# EAGLE design ESP adapter circuit diagram (EAGLE 7.2.0)
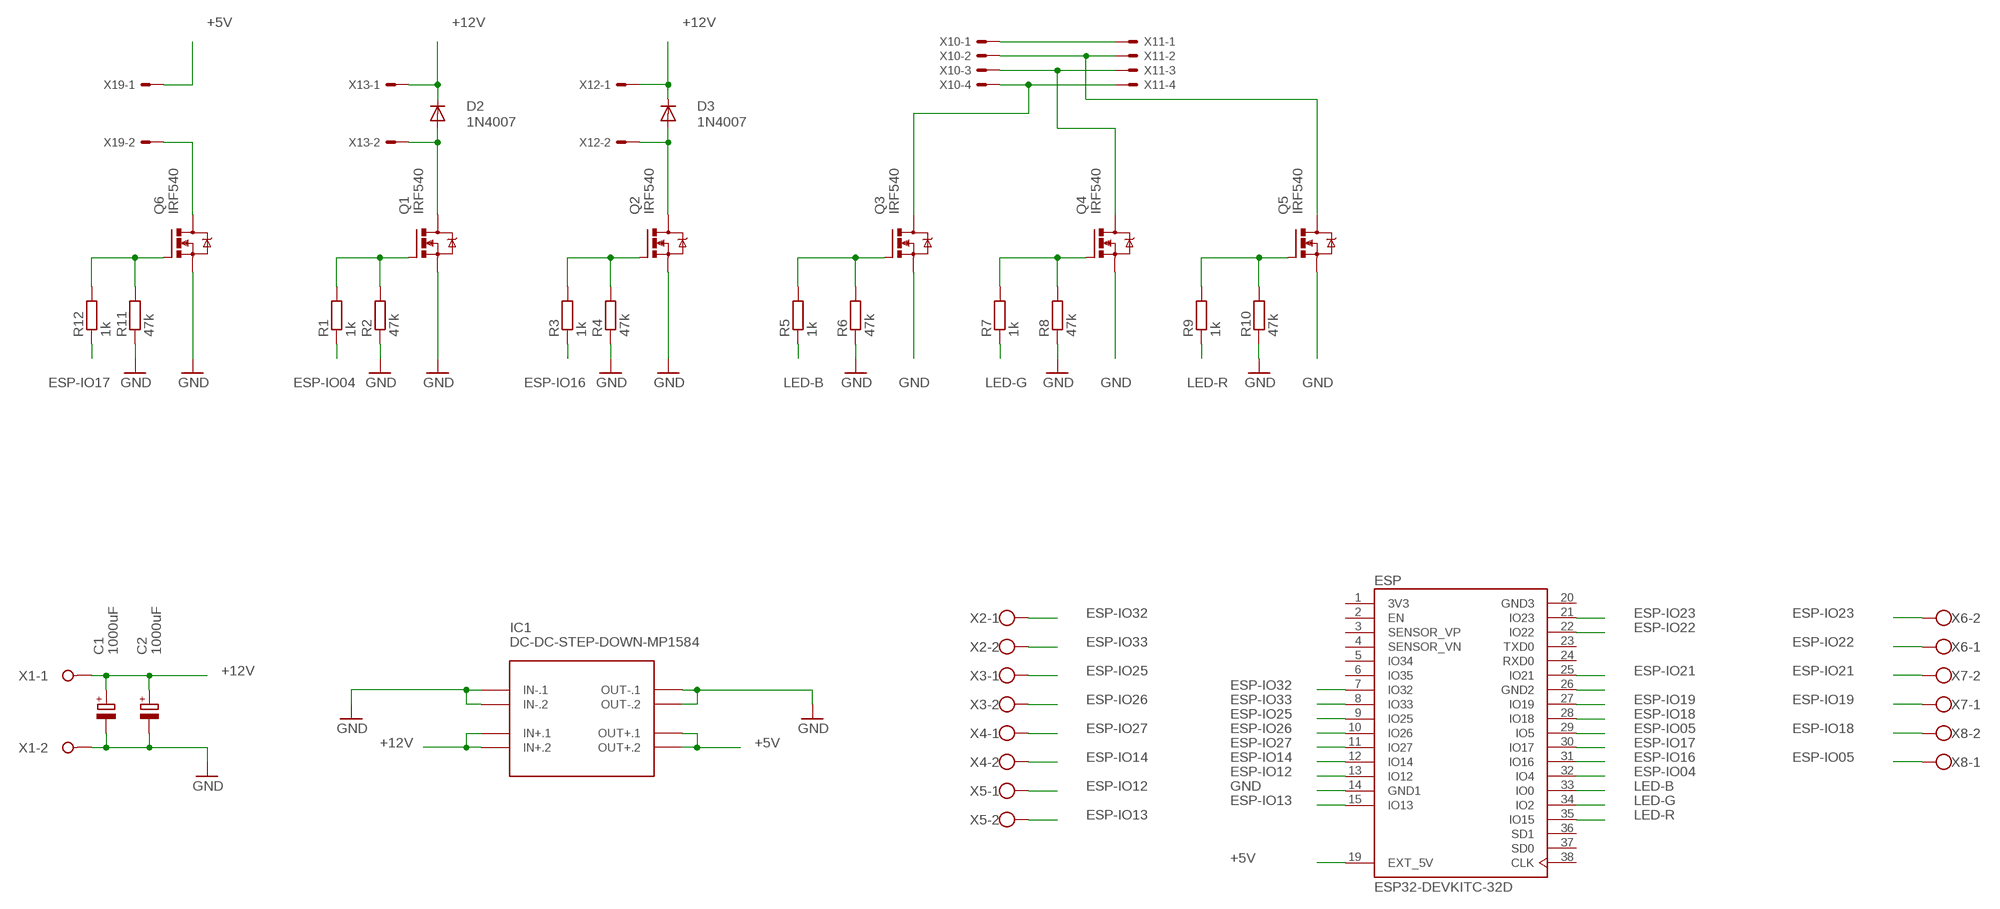
[diagram p0: schematic, sheet 1]

## Parts
C1  1000uF  CPOL-EUE5-13  [E5-13]
C2  1000uF  CPOL-EUE5-13  [E5-13]
D2  1N4007  1N4004  [DO41-10]
D3  1N4007  1N4004  [DO41-10]
ESP  ESP32-DEVKITC-32D  [MODULE_ESP32-DEVKITC-32D]
IC1  DC-DC-STEP-DOWN-MP1584  [DC-DC-STEP-DOWN-MP1584]
Q1  IRF540  [TO220BV]
Q2  IRF540  [TO220BV]
Q3  IRF540  [TO220BV]
Q4  IRF540  [TO220BV]
Q5  IRF540  [TO220BV]
Q6  IRF540  [TO220BV]
R1  1k  R-EU_0204/7  [0204/7]
R2  47k  R-EU_0204/7  [0204/7]
R3  1k  R-EU_0204/7  [0204/7]
R4  47k  R-EU_0204/7  [0204/7]
R5  1k  R-EU_0204/7  [0204/7]
R6  47k  R-EU_0204/7  [0204/7]
R7  1k  R-EU_0204/7  [0204/7]
R8  47k  R-EU_0204/7  [0204/7]
R9  1k  R-EU_0204/7  [0204/7]
R10  47k  R-EU_0204/7  [0204/7]
R11  47k  R-EU_0204/7  [0204/7]
R12  1k  R-EU_0204/7  [0204/7]
X1  GND  W237-02P  [W237-132]
X2  W237-102  [W237-102]
X3  W237-102  [W237-102]
X4  W237-102  [W237-102]
X5  W237-102  [W237-102]
X6  W237-102  [W237-102]
X7  W237-102  [W237-102]
X8  W237-102  [W237-102]
X10  22-27-2041-04  [6410-04]
X11  22-27-2041-04  [6410-04]
X12  22-27-2021-02  [6410-02]
X13  22-27-2021-02  [6410-02]
X19  22-27-2021-02  [6410-02]

## Nets
+5V: ESP.19(EXT_5V) IC1.OUT+.1 IC1.OUT+.2 X19.1
+12V: C1.+ C2.+ D2.C D3.C IC1.IN+.1 IC1.IN+.2 X1.1 X10.1 X11.1 X12.1 X13.1
ESP-IO04: ESP.32(IO4) R1.1
ESP-IO05: ESP.29(IO5) X8.1
ESP-IO12: ESP.13(IO12) X5.1
ESP-IO13: ESP.15(IO13) X5.2
ESP-IO14: ESP.12(IO14) X4.2
ESP-IO16: ESP.31(IO16) R3.1
ESP-IO17: ESP.30(IO17) R12.1
ESP-IO18: ESP.28(IO18) X8.2
ESP-IO19: ESP.27(IO19) X7.1
ESP-IO21: ESP.25(IO21) X7.2
ESP-IO22: ESP.22(IO22) X6.1
ESP-IO23: ESP.21(IO23) X6.2
ESP-IO25: ESP.9(IO25) X3.1
ESP-IO26: ESP.10(IO26) X3.2
ESP-IO27: ESP.11(IO27) X4.1
ESP-IO32: ESP.7(IO32) X2.1
ESP-IO33: ESP.8(IO33) X2.2
GND: C1.- C2.- ESP.14(GND1) IC1.IN-.1 IC1.IN-.2 IC1.OUT-.1 IC1.OUT-.2 Q1.S Q2.S Q3.S Q4.S Q5.S Q6.S R2.1 R4.1 R6.1 R8.1 R10.1 R11.1 X1.2
LED-B: ESP.33(IO0) R5.1
LED-G: ESP.34(IO2) R7.1
LED-R: ESP.35(IO15) R9.1
N$3: ESP.26(GND2)
N$25: Q1.G R1.2 R2.2
N$26: Q2.G R3.2 R4.2
N$27: Q3.G R5.2 R6.2
N$28: D2.A Q1.D X13.2
N$29: Q5.D X10.2 X11.2
N$30: Q6.G R11.2 R12.2
N$31: Q3.D X10.4 X11.4
N$33: Q4.D X10.3 X11.3
N$34: Q4.G R7.2 R8.2
N$35: Q5.G R9.2 R10.2
N$39: Q6.D X19.2
N$41: D3.A Q2.D X12.2
Unconnected: ESP.2(EN) ESP.3(SENSOR_VP) ESP.4(SENSOR_VN) ESP.5(IO34) ESP.6(IO35) ESP.23(TXD0) ESP.24(RXD0) ESP.36(SD1) ESP.37(SD0) ESP.38(CLK)

## Power pins joined to a net without a drawn wire
3V3: ESP.1(3V3)
GND3: ESP.20(GND3)

## Library data of the parts
C1 C2 = rcl:CPOL-EU: POLARIZED CAPACITOR, European symbol
D2 D3 = diode:1N4004: DIODE general purpose rectifier, 1 A
ESP = ESP32-DEVKITC-32D-final:ESP32-DEVKITC-32D: Eval Board For Esp-Wroom-32; AVAILABILITY: Unavailable; DESCRIPTION: Eval Board For Esp-Wroom-32; MF: Espressif Systems; MP: ESP32-DEVKITC-32D; PACKAGE: None; PRICE: None
IC1 = diy-modules:DC-DC-STEP-DOWN-MP1584: DC/DC Step-Down Regulator based on MP1584 chip MP1584 datasheet available here: http://www.haoyuelectronics.com/Attachment/MP1584/MP1584.pdf Click here to find device on ebay.com <http://www.ebay.com/sch/mp1584+module>
Q1-Q6 = transistor-power:IRF540: HEXFET Power MOSFET
R1-R12 = rcl:R-EU_: RESISTOR, European symbol
X1 = con-wago-508:W237-02P: WAGO SREW CLAMP; OC_FARNELL: unknown; OC_NEWARK: unknown
X2-X8 = con-wago-500:W237-102: WAGO SCREW CLAMP; MPN: 237-102; OC_FARNELL: unknown; OC_NEWARK: 70K9898
X10 X11 = con-molex:22-?-04: CONNECTOR wire to board 2.54 mm (.1 inch) pitch header; OC_FARNELL: unknown; OC_NEWARK: unknown
X12 X13 X19 = con-molex:22-?-02: CONNECTOR wire to board 2.54 mm (.1 inch) pitch header; OC_FARNELL: unknown; OC_NEWARK: unknown

## Board
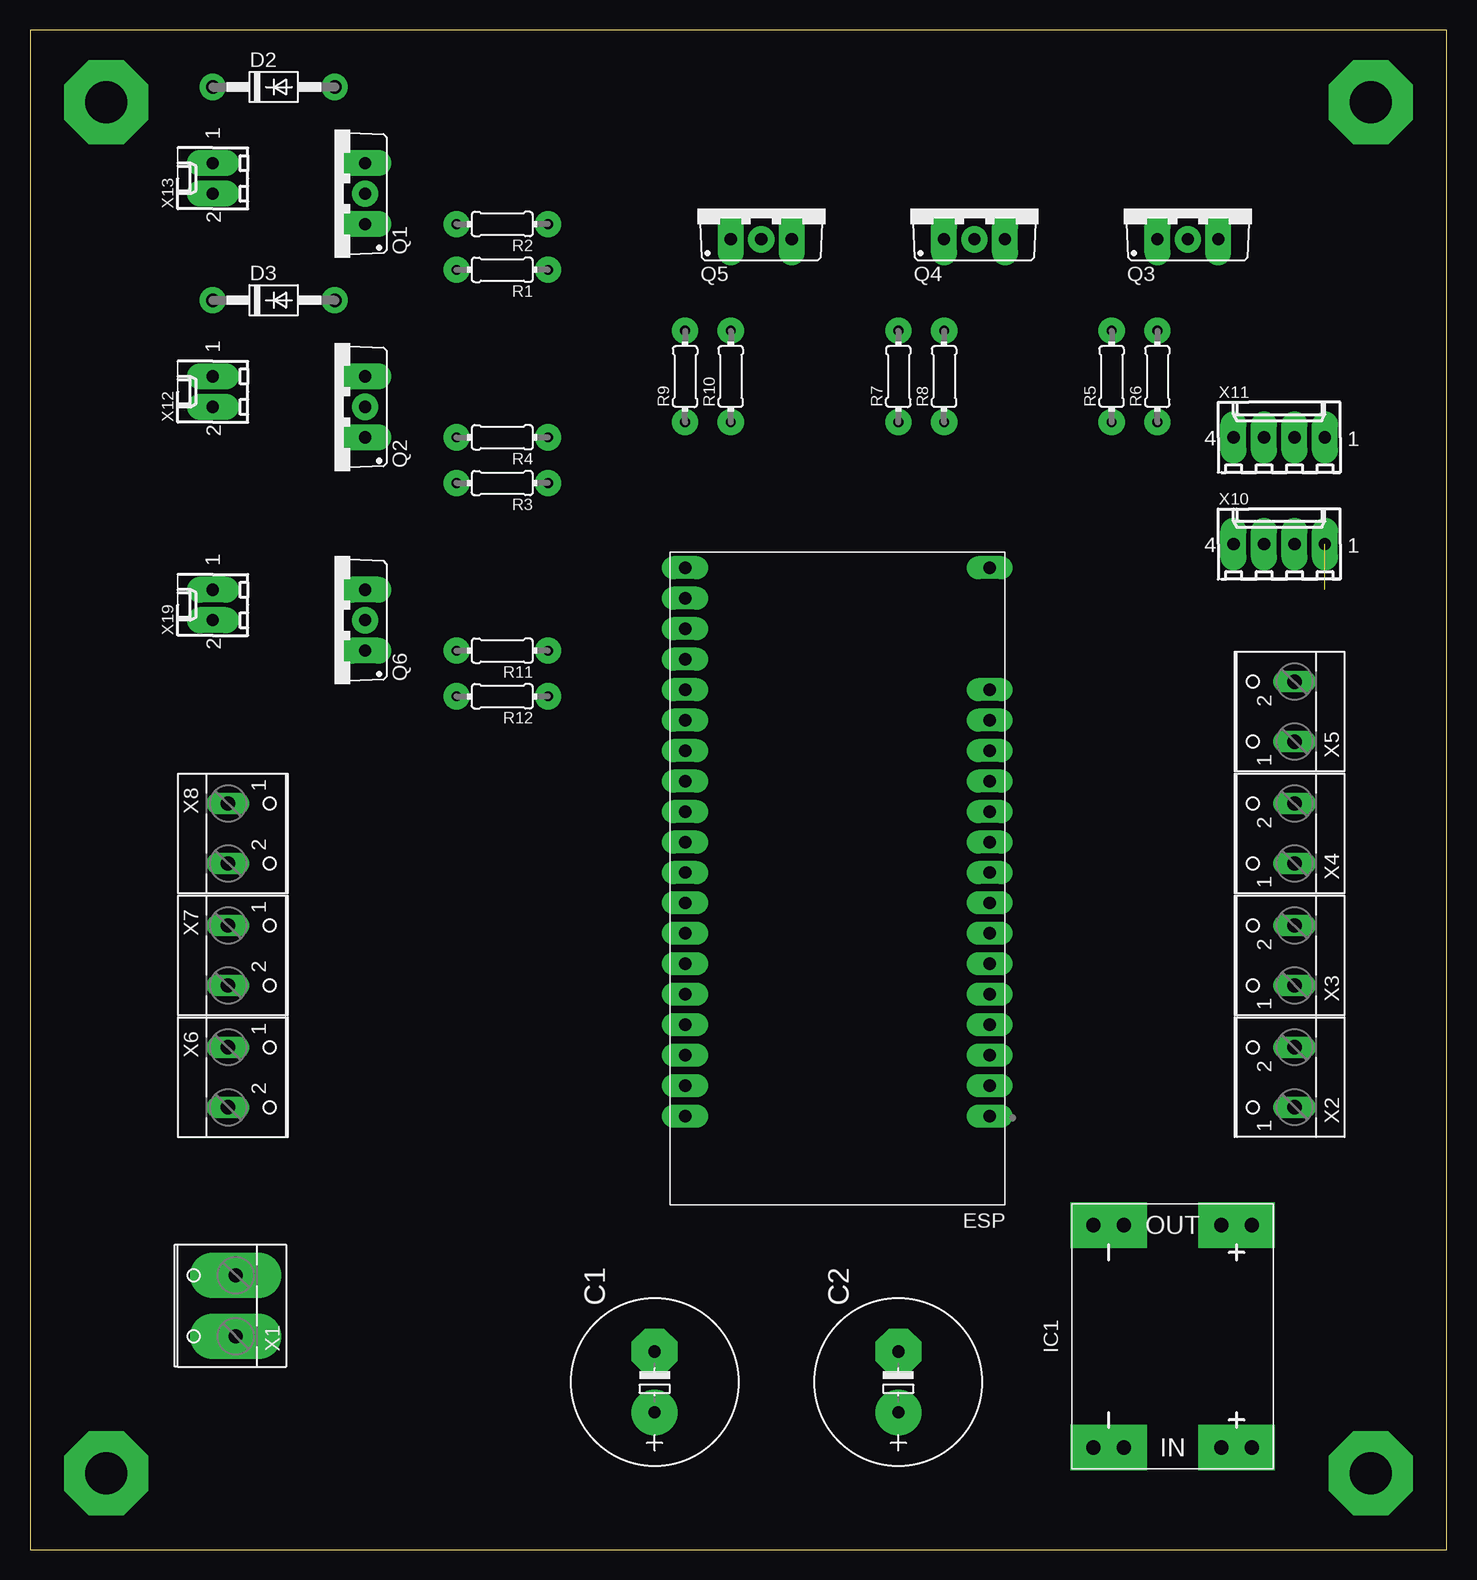
[diagram p1: board, top side]
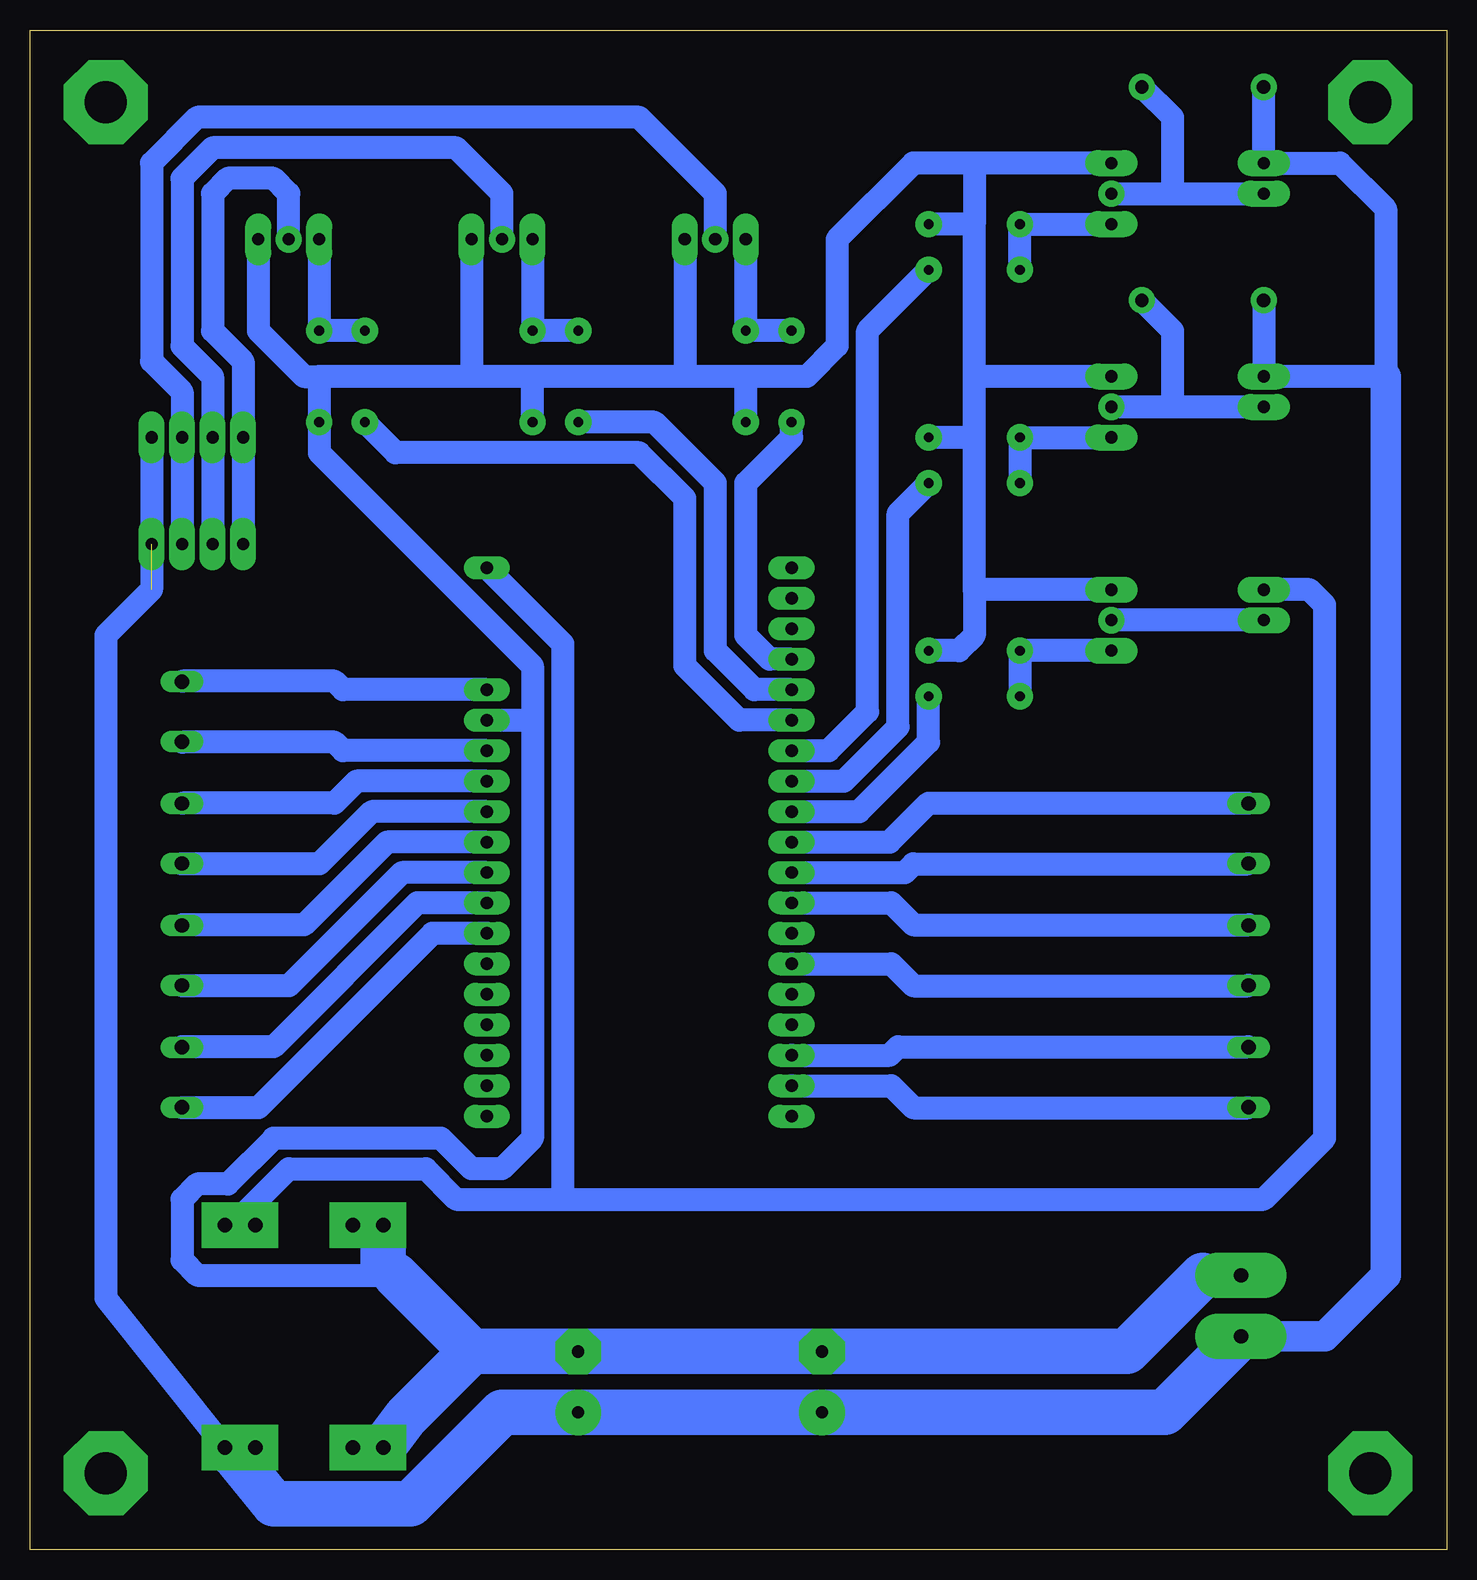
[diagram p2: board, bottom side, seen from below]

Size 118.09 x 126.67 mm. Coordinates in mm from the lower left corner, seen from the top.
Outline: 0,0 118.09,0 118.09,126.67 0,126.67 0,0
Copper layers (1*16): Top 0.035mm / dielectric 1.5mm / Bottom 0.035mm
Design rules "default": minimum track width 10mil, minimum drill 24mil, track to track 8mil, track to pad 8mil, pad to pad 8mil, via to via 8mil, smd to smd 8mil, copper to edge 40mil, drill to drill 8mil, minimum pad ring 10mil, minimum via ring 8mil, stop-mask expansion 4mil, vias tented up to drill 0mil, thermal gap 10mil

### Footprints (pad centres in the part's own frame; a part is rotated, then mirrored left to right if it is on the bottom)
E5-13 = drill 1.016 pad 3.81: + -2.54,0 | drill 1.016 pad 3.81 octagon: - 2.54,0
DO41-10 = drill 1.118 pad 2.184: A 5.08,0; C -5.08,0
MODULE_ESP32-DEVKITC-32D = drill 1.04 pad 1.93 long: 1 -12.7,19.76; 2 -12.7,17.22; 3 -12.7,14.68; 4 -12.7,12.14; 5 -12.7,9.6; 6 -12.7,7.06; 7 -12.7,4.52; 8 -12.7,1.98; 9 -12.7,-0.56; 10 -12.7,-3.1; 11 -12.7,-5.64; 12 -12.7,-8.18; 13 -12.7,-10.72; 14 -12.7,-13.26; 15 -12.7,-15.8; 19 -12.7,-25.96; 20 12.7,19.76; 21 12.7,17.22; 22 12.7,14.68; 23 12.7,12.14; 24 12.7,9.6; 25 12.7,7.06; 26 12.7,4.52; 27 12.7,1.98; 28 12.7,-0.56; 29 12.7,-3.1; 30 12.7,-5.64; 31 12.7,-8.18; 32 12.7,-10.72; 33 12.7,-13.26; 34 12.7,-15.8; 35 12.7,-18.34; 36 12.7,-20.88; 37 12.7,-23.42; 38 12.7,-25.96
DC-DC-STEP-DOWN-MP1584 = drill 1.2 pad 3.81 square: IN+.1 -9.271,-4.064; IN+.2 -9.271,-6.604; IN-.1 -9.271,6.604; IN-.2 -9.271,4.064; OUT+.1 9.271,-4.064; OUT+.2 9.271,-6.604; OUT-.1 9.271,6.604; OUT-.2 9.271,4.064
TO220BV = drill 1.016 pad 2.184: D 0,-2.54 | drill 1.016 pad 2.184 long: G -2.54,-2.54; S 2.54,-2.54
0204/7 = drill 0.813 pad 2.184: 1 -3.81,0; 2 3.81,0
W237-132 = drill 1.194 pad 3.81 long: 1 -2.54,-0.635; 2 2.54,-0.635
W237-102 = drill 1.194 long: 1 -2.5,-1.27; 2 2.5,-1.27
6410-04 = drill 1.016 pad 2.184 long: 1 3.81,0; 2 1.27,0; 3 -1.27,0; 4 -3.81,0
6410-02 = drill 1.016 pad 2.184 long: 1 1.27,0; 2 -1.27,0

### Placement (x,y rotation side)
C1  52.07,13.97 90 top
C2  72.39,13.97 90 top
D2  20.32,121.92 0 top
D3  20.32,104.14 0 top
ESP  67.31,55.88 180 top
IC1  95.25,17.78 90 top
Q1  25.4,113.03 90 top
Q2  25.4,95.25 90 top
Q3  96.52,111.76 0 top
Q4  78.74,111.76 0 top
Q5  60.96,111.76 0 top
Q6  25.4,77.47 90 top
R1  39.37,106.68 180 top
R2  39.37,110.49 180 top
R3  39.37,88.9 180 top
R4  39.37,92.71 180 top
R5  90.17,97.79 90 top
R6  93.98,97.79 90 top
R7  72.39,97.79 90 top
R8  76.2,97.79 90 top
R9  54.61,97.79 90 top
R10  58.42,97.79 90 top
R11  39.37,74.93 180 top
R12  39.37,71.12 180 top
X1  16.51,20.32 90 top
X2  104.14,39.37 90 top
X3  104.14,49.53 90 top
X4  104.14,59.69 90 top
X5  104.14,69.85 90 top
X6  17.78,39.37 270 top
X7  17.78,49.53 270 top
X8  17.78,59.69 270 top
X10  104.14,83.82 0 top
X11  104.14,92.71 0 top
X12  15.24,96.52 90 top
X13  15.24,114.3 90 top
X19  15.24,78.74 90 top

### Tracks (layer width: path | path; a pad name or v marks a point on that pad's centre or on a via)
+5V
  Bottom 1.93: IC1.OUT+.2 100.33,27.05 | 100.33,27.05 IC1.OUT+.1 | 73.66,29.21 73.66,75.49 ESP.19 | 73.66,29.21 82.55,29.21 85.09,31.75 96.52,31.75 100.33,27.94 100.33,27.05 | 73.66,29.21 15.24,29.21 10.16,34.29 10.16,78.74 11.43,80.01 X19.1
+12V  (1 unrouted)
  Bottom 1.93: X11.1 107.95,80.01 111.76,76.2 111.76,20.95 IC1.IN+.2 101.6,8.51 | D3.C X12.1 5.08,97.79 5.08,111.76 8.89,115.57 X13.1 D2.C
  Bottom 2.54: X1.1 10.16,17.78 5.08,22.86 5.08,97.79
  Bottom 3.81: IC1.IN+.1 101.6,8.51 97.79,3.81 86.36,3.81 78.74,11.43 C2.+ C1.+ 23.5,11.43 X1.1
ESP-IO04
  Bottom 1.93: ESP.32 51.51,66.6 48.26,69.85 48.26,101.6 R1.1
ESP-IO05
  Bottom 0.406: 16.55,62.23 X8.1
  Bottom 1.93: ESP.29 46.43,58.98 43.18,62.23 16.55,62.23
ESP-IO12
  Bottom 0.406: 105.37,67.31 X5.1
  Bottom 1.93: ESP.13 92,66.6 92.71,67.31 105.37,67.31
ESP-IO13
  Bottom 0.406: 105.37,72.39 X5.2
  Bottom 1.93: ESP.15 92,71.68 92.71,72.39 105.37,72.39
ESP-IO14
  Bottom 0.406: 105.37,62.23 X4.2
  Bottom 1.93: ESP.12 90.88,64.06 92.71,62.23 105.37,62.23
ESP-IO16
  Bottom 1.93: ESP.31 50.24,64.06 45.72,68.58 45.72,86.36 R3.1
ESP-IO17
  Bottom 1.93: ESP.30 48.97,61.52 43.18,67.31 R12.1
ESP-IO18
  Bottom 0.406: 16.55,57.15 X8.2
  Bottom 1.93: ESP.28 45.16,56.44 44.45,57.15 16.55,57.15
ESP-IO19
  Bottom 0.406: 15.24,52.07 16.47,52.07 X7.1
  Bottom 1.93: ESP.27 46.28,53.9 44.45,52.07 16.47,52.07
ESP-IO21
  Bottom 1.93: ESP.25 46.28,48.82 44.45,46.99 16.55,46.99 X7.2
ESP-IO22
  Bottom 0.406: 16.55,41.91 X6.1
  Bottom 1.93: ESP.22 46.43,41.2 45.72,41.91 16.55,41.91
ESP-IO23
  Bottom 0.406: 16.55,36.83 X6.2
  Bottom 1.93: ESP.21 46.28,38.66 44.45,36.83 16.55,36.83
ESP-IO25
  Bottom 0.406: 105.37,46.99 X3.1
  Bottom 1.93: ESP.9 87.07,56.44 96.52,46.99 105.37,46.99
ESP-IO26
  Bottom 0.406: 105.37,52.07 X3.2
  Bottom 1.93: ESP.10 88.34,58.98 95.25,52.07 105.37,52.07
ESP-IO27
  Bottom 0.406: 106.68,57.15 105.45,57.15 X4.1
  Bottom 1.93: ESP.11 89.61,61.52 93.98,57.15 105.45,57.15
ESP-IO32
  Bottom 0.406: 105.37,36.83 X2.1
  Bottom 1.93: ESP.7 84.53,51.36 99.06,36.83 105.37,36.83
ESP-IO33
  Bottom 0.406: 105.41,41.91 X2.2
  Bottom 1.93: ESP.8 85.8,53.9 97.79,41.91 105.41,41.91
GND
  Bottom 1.93: Q6.S 39.37,80.01 | 39.37,80.01 39.37,76.2 40.64,74.93 R11.1 | 39.37,80.01 39.37,92.71 | 39.37,92.71 39.37,97.79 | 39.37,97.79 39.37,110.49 | 39.37,110.49 R2.1 | 39.37,92.71 R4.1 | Q2.S 39.37,97.79 | Q1.S 39.37,115.57 | 39.37,115.57 39.37,110.49 | 39.37,115.57 44.45,115.57 50.8,109.22 50.8,100.33 53.34,97.79 58.42,97.79 | 58.42,97.79 63.5,97.79 | 63.5,97.79 76.2,97.79 | 76.2,97.79 81.28,97.79 | 81.28,97.79 93.98,97.79 | 93.98,97.79 R6.1 93.98,91.44 76.2,73.66 76.2,68.58 | R8.1 76.2,97.79 | R10.1 58.42,97.79 | Q5.S 63.5,97.79 | Q4.S 81.28,97.79 | Q3.S 99.06,101.6 95.25,97.79 93.98,97.79 | 20.32,22.86 X1.2 | 88.65,23.88 87.63,22.86 104.14,22.86 105.41,24.13 105.41,29.21 104.14,30.48 101.6,30.48 97.79,34.29 83.82,34.29 81.28,31.75 78.74,31.75 76.2,34.29 76.2,68.58 | ESP.14 76.76,69.14 76.2,68.58
  Bottom 3.81: IC1.IN-.2 IC1.IN-.1 86.74,11.05 81.28,16.51 | 81.28,16.51 C2.- C1.- 26.67,16.51 20.32,22.86 | 16.51,22.86 X1.2 | 81.28,16.51 87.63,22.86 | 88.65,23.88 IC1.OUT-.1 IC1.OUT-.2
LED-B
  Bottom 1.93: ESP.33 58.98,69.14 63.5,73.66 63.5,87.63 67.31,91.44 87.63,91.44 R5.1
LED-G
  Bottom 1.93: ESP.34 57.71,71.68 60.96,74.93 60.96,88.9 66.04,93.98 R7.1
LED-R
  Bottom 1.93: ESP.35 56.44,74.22 58.42,76.2 58.42,88.9 54.61,92.71 R9.1
N$25
  Bottom 1.93: R1.2 R2.2 Q1.G
N$26
  Bottom 1.93: R3.2 R4.2 Q2.G
N$27
  Bottom 1.93: R5.2 R6.2 Q3.G
N$28
  Bottom 1.93: Q1.D 22.86,113.03 | 22.86,113.03 X13.2 | D2.A 22.86,119.38 22.86,113.03
N$29
  Bottom 1.93: Q5.D 60.96,113.03 67.31,119.38 104.14,119.38 107.95,115.57 107.95,99.06 105.41,96.52 X11.2 X10.2
N$30
  Bottom 1.93: Q6.G R11.2 R12.2
N$31
  Bottom 1.93: Q3.D 96.52,113.03 97.79,114.3 101.6,114.3 102.87,113.03 102.87,101.6 100.33,99.06 X11.4 X10.4
N$32  (via drill 3.5 pad 7)
  other vias: 6.35,120.65
N$33
  Bottom 1.93: Q4.D 78.74,113.03 82.55,116.84 102.87,116.84 105.41,114.3 105.41,100.33 102.87,97.79 X11.3 X10.3
N$34
  Bottom 1.93: R7.2 R8.2 Q4.G
N$35
  Bottom 1.93: R9.2 R10.2 Q5.G
N$36  (via drill 3.5 pad 7)
  other vias: 111.76,120.65
N$37  (via drill 3.5 pad 7)
  other vias: 111.76,6.35
N$38  (via drill 3.5 pad 7)
  other vias: 6.35,6.35
N$39
  Bottom 1.93: X19.2 Q6.D
N$41
  Bottom 1.93: X12.2 22.86,95.25 | 22.86,95.25 Q2.D | D3.A 22.86,101.6 22.86,95.25